# EAGLE design SUPEROLED8 (EAGLE 6.5.0)
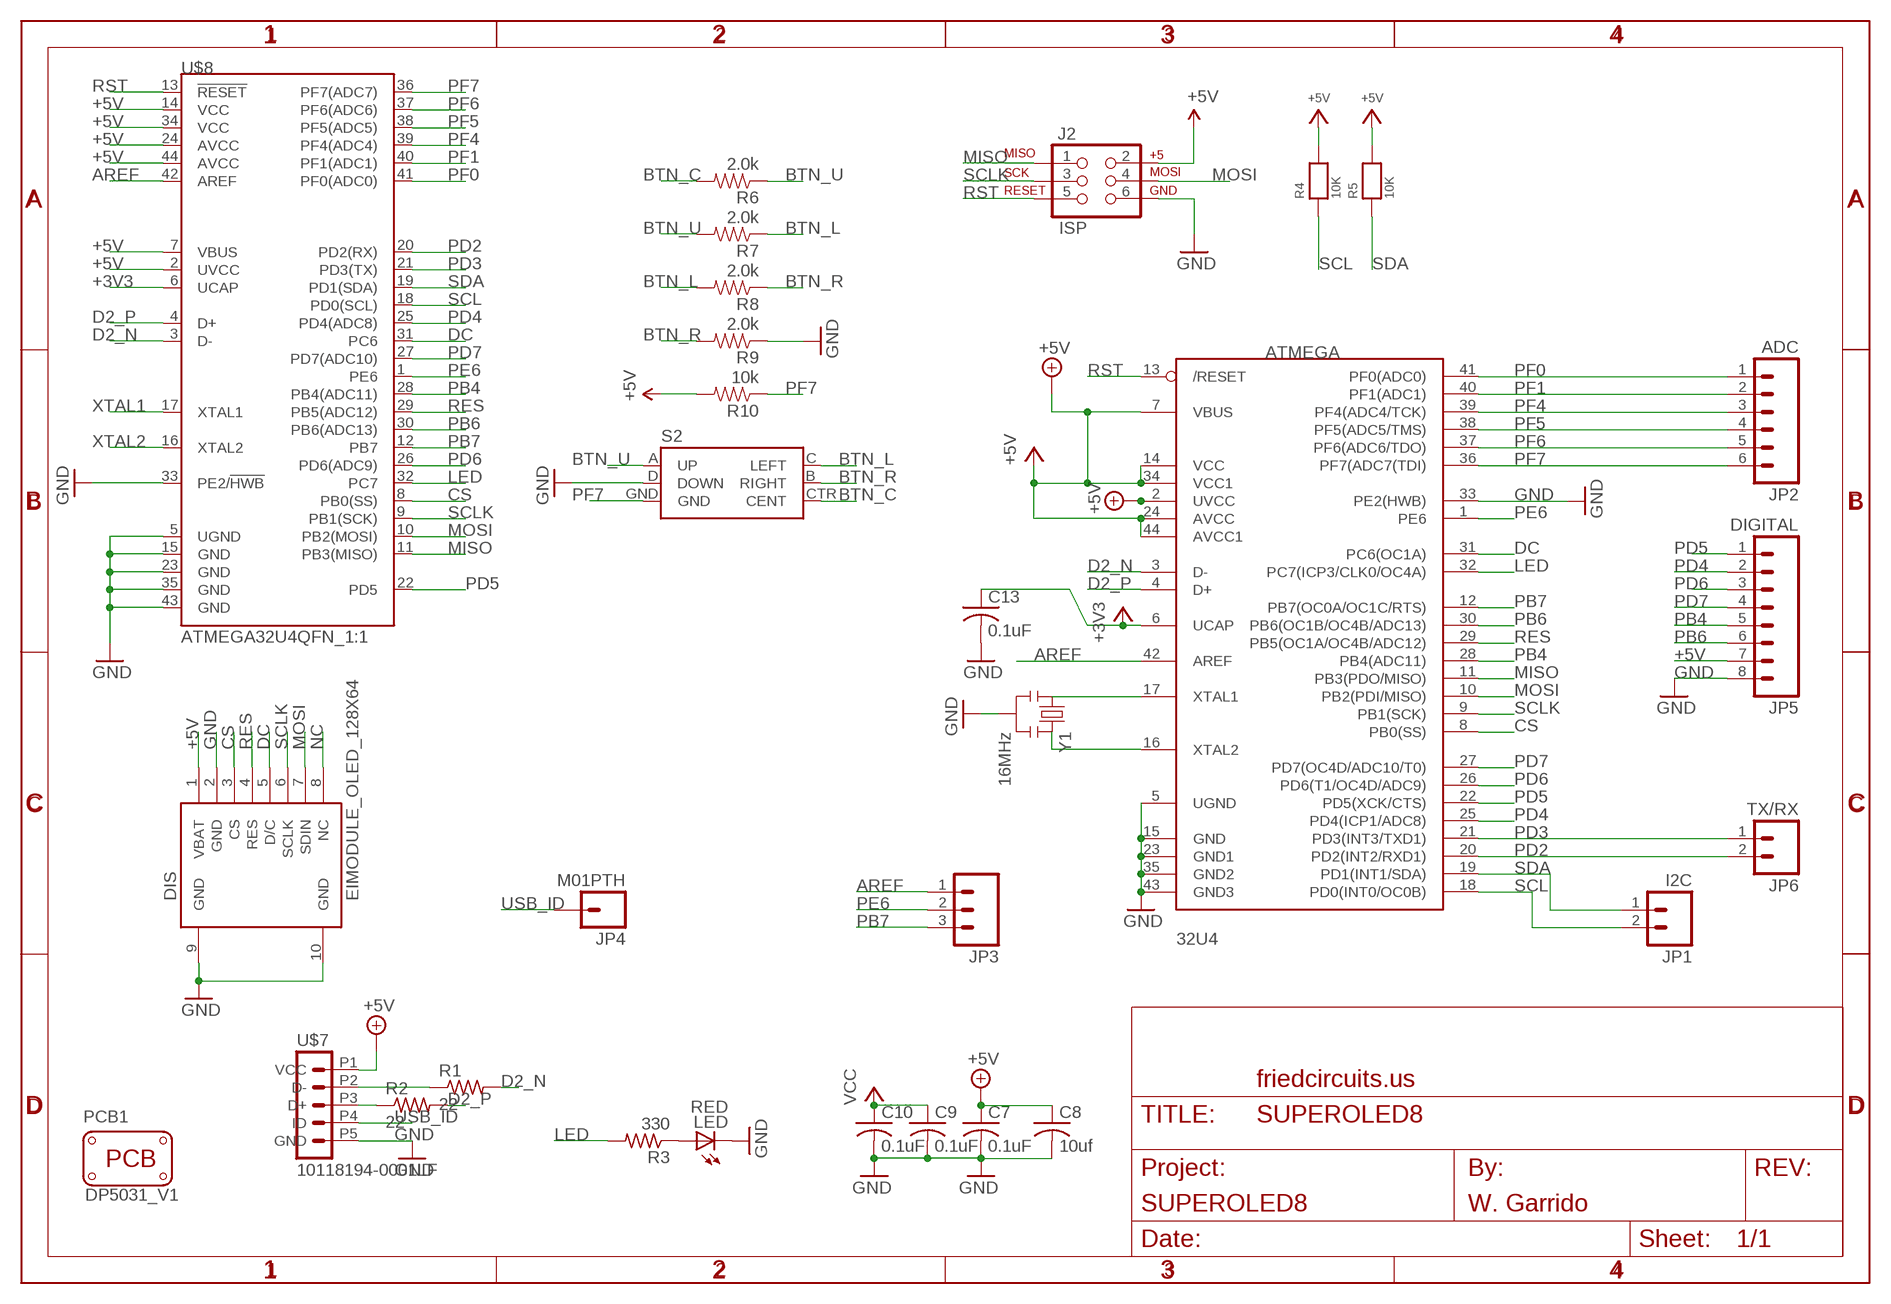
[diagram p0: schematic, sheet 1]

## Parts
32U4  ATMEGA  ATMEGA32U4-AU  [TQFP44]
C7  0.1uF  C-USC0805K  [C0805K]
C8  10uf  C-USC0805K  [C0805K]
C9  0.1uF  C-USC0805K  [C0805K]
C10  0.1uF  C-USC0805K  [C0805K]
C13  0.1uF  C-USC0805K  [C0805K]
DIS  EIMODULE_OLED_128X64  [EIMODULE_OLED_128X64]
J2  ISP  AVR_SPI_PRG_62X3_LOCK  [2X3_LOCK]
JP1  I2C  M02LOCK  [1X02_LOCK]
JP2  ADC  M06LOCK  [1X06_LOCK]
JP3  M03LOCK  [1X03_LOCK]
JP4  M01PTH  [1X01]
JP5  DIGITAL  M08LOCK  [1X08_LOCK]
JP6  TX/RX  M02LOCK  [1X02_LOCK]
LED  RED  LEDCHIPLED_0805  [CHIPLED_0805]
PCB1  PCB_DP_RECTANGLE-31X50  [DP5031_V1]
R1  22  R-US_R0805  [R0805]
R2  22  R-US_R0805  [R0805]
R3  330  R-US_R0805  [R0805]
R4  10K  RESISTOR0805  [0805]
R5  10K  RESISTOR0805  [0805]
R6  2.0k  2.0KOHM1/10W5%(0603)  [0603-RES]
R7  2.0k  2.0KOHM1/10W5%(0603)  [0603-RES]
R8  2.0k  2.0KOHM1/10W5%(0603)  [0603-RES]
R9  2.0k  2.0KOHM1/10W5%(0603)  [0603-RES]
R10  10k  2.0KOHM1/10W5%(0603)  [0603-RES]
S2  JOYSTICK_MINI  [JOYSTICK_MINI]
U$1  FRAME_DINA4_L  [FC_CREDIT]
U$7  10118194-0001LF  [10118194-0001LF]
U$8  ATMEGA32U4QFN_1:1  [QFN-44-NOPAD_1:1]
Y1  16MHz  RESONATOR16MHZ  [RESONATOR-SMD]

## Nets
+3V3 [+3V3]: 32U4.6(UCAP) C13.1 U$8.6(UCAP)
+5V [+5V]: 32U4.2(UVCC) 32U4.7(VBUS) 32U4.14(VCC) 32U4.24(AVCC) 32U4.34(VCC1) 32U4.44(AVCC1) C7.1 C8.1 C9.1 C10.1 DIS.1(VBAT) J2.2 JP5.7 R4.2 R5.2 R10.2 U$7.P1(VCC) U$8.2(UVCC) U$8.7(VBUS) U$8.14(VCC) U$8.24(AVCC) U$8.34(VCC) U$8.44(AVCC) ; supply symbol labelled VCC
AREF: 32U4.42(AREF) JP3.1 U$8.42(AREF)
BTN_C: R6.2 S2.CTR(CENT)
BTN_L: R7.1 R8.2 S2.C(LEFT)
BTN_R: R8.1 R9.2 S2.B(RIGHT)
BTN_U: R6.1 R7.2 S2.A(UP)
CS: 32U4.8(PB0(SS)) DIS.3(CS) U$8.8(PB0(SS))
D2_N [USB]: 32U4.3(D-) R1.2 U$8.3(D-)
D2_P [USB]: 32U4.4(D+) R2.2 U$8.4(D+)
DC: 32U4.31(PC6(OC1A)) DIS.5(D/C) U$8.31(PC6)
GND: 32U4.5(UGND) 32U4.15(GND) 32U4.23(GND1) 32U4.33(PE2(HWB)) 32U4.35(GND2) 32U4.43(GND3) C7.2 C8.2 C9.2 C10.2 C13.2 DIS.2(GND) DIS.9(GND) DIS.10(GND) J2.6 JP5.8 LED.C R9.1 S2.D(DOWN) U$7.P5(GND) U$8.5(UGND) U$8.15(GND) U$8.23(GND) U$8.35(GND) U$8.43(GND) Y1.2
LED: 32U4.32(PC7(ICP3/CLK0/OC4A)) R3.2 U$8.32(PC7)
MISO: 32U4.11(PB3(PDO/MISO)) J2.1 U$8.11(PB3(MISO))
MOSI: 32U4.10(PB2(PDI/MISO)) DIS.7(SDIN) J2.4 U$8.10(PB2(MOSI))
N$1: LED.A R3.1
N$25: U$8.33(PE2/!HWB)
NC: DIS.8(NC)
PB4: 32U4.28(PB4(ADC11)) JP5.5 U$8.28(PB4(ADC11))
PB6: 32U4.30(PB6(OC1B/OC4B/ADC13)) JP5.6 U$8.30(PB6(ADC13))
PB7: 32U4.12(PB7(OC0A/OC1C/RTS)) JP3.3 U$8.12(PB7)
PD2: 32U4.20(PD2(INT2/RXD1)) JP6.2 U$8.20(PD2(RX))
PD3: 32U4.21(PD3(INT3/TXD1)) JP6.1 U$8.21(PD3(TX))
PD4: 32U4.25(PD4(ICP1/ADC8)) JP5.2 U$8.25(PD4(ADC8))
PD5: 32U4.22(PD5(XCK/CTS)) JP5.1 U$8.22(PD5)
PD6: 32U4.26(PD6(T1/OC4D/ADC9)) JP5.3 U$8.26(PD6(ADC9))
PD7: 32U4.27(PD7(OC4D/ADC10/T0)) JP5.4 U$8.27(PD7(ADC10))
PE6: 32U4.1(PE6) JP3.2 U$8.1(PE6)
PF0: 32U4.41(PF0(ADC0)) JP2.1 U$8.41(PF0(ADC0))
PF1: 32U4.40(PF1(ADC1)) JP2.2 U$8.40(PF1(ADC1))
PF4: 32U4.39(PF4(ADC4/TCK)) JP2.3 U$8.39(PF4(ADC4))
PF5: 32U4.38(PF5(ADC5/TMS)) JP2.4 U$8.38(PF5(ADC5))
PF6: 32U4.37(PF6(ADC6/TDO)) JP2.5 U$8.37(PF6(ADC6))
PF7: 32U4.36(PF7(ADC7(TDI)) JP2.6 R10.1 S2.GND U$8.36(PF7(ADC7))
RES: 32U4.29(PB5(OC1A/OC4B/ADC12)) DIS.4(RES) U$8.29(PB5(ADC12))
RST: 32U4.13(/RESET) J2.5 U$8.13(!RESET)
SCL: 32U4.18(PD0(INT0/OC0B)) JP1.2 R4.1 U$8.18(PD0(SCL))
SCLK: 32U4.9(PB1(SCK)) DIS.6(SCLK) J2.3 U$8.9(PB1(SCK))
SDA: 32U4.19(PD1(INT1/SDA)) JP1.1 R5.1 U$8.19(PD1(SDA))
USB_C_N [USB]: R1.1 U$7.P2(D-)
USB_C_P [USB]: R2.1 U$7.P3(D+)
USB_ID: JP4.1 U$7.P4(ID)
XTAL1: 32U4.17(XTAL1) U$8.17(XTAL1) Y1.1
XTAL2: 32U4.16(XTAL2) U$8.16(XTAL2) Y1.3

## Library data of the parts
32U4 = adafruit:ATMEGA32U4: http://www.ladyada.net/library/eagle
C7-C10 C13 = adafruit:C-US: CAPACITOR, American symbol
DIS = FriedCircuits:EIMODULE_OLED_128X64
J2 = SparkFun-Connectors:AVR_SPI_PRG_6: AVR ISP 6 Pin This is the reduced ISP connector for AVR programming. Common on Arduino. This footprint will take up less PCB space and can be used with a 10-pin to 6-pin adapter such as SKU: BOB-08508
JP1 JP6 = SparkFun-Connectors:M02: Standard 2-pin 0.1" header. Use with - straight break away headers ( PRT-00116) - right angle break away headers (PRT-00553) - swiss pins (PRT-00743) - machine pins (PRT-00117) - female headers (PRT-00115) Molex polarized connector foot print use with: PRT-08233 with associated crimp pins and housings. 2.54_SCREWTERM for use with PRT-10571. 3.5mm Screw Terminal footprints for PRT-08084 5mm Screw Terminal footprints for use with PRT-08433
JP2 = SparkFun-Connectors:M06: Header 6 Standard 6-pin 0.1" header. Use with straight break away headers (SKU : PRT-00116), right angle break away headers (PRT-00553), swiss pins (PRT-00743), machine pins (PRT-00117), and female headers (PRT-00115). Molex polarized connector foot print use with SKU : PRT-08094 with associated crimp pins and housings. NOTES ON THE VARIANTS LOCK and LOCK_LONGPADS... This footprint was designed to help hold the alignment of a through-hole component (i.e. 6-pin header) while soldering it into place. You may notice that each hole has been shifted either up or down by 0.005 of an inch from it's more standard position (which is a perfectly straight line). This slight alteration caused the pins (the squares in the middle) to touch the edges of the holes. Because they are alternating, it causes a "brace" to hold the component in place. 0.005 has proven to be the perfect amount of "off-center" position when using our standard breakaway headers. Although looks a little odd when you look at the bare footprint, once you have a header in there, the alteration is very hard to notice. Also,if you push a header all the way into place, it is covered up entirely on the bottom side. This idea of altering the position of holes to aid alignment will be further integrated into the Sparkfun Library for other footprints. It can help hold any component with 3 or more connection pins.
JP3 = SparkFun-Connectors:M03: Header 3 Standard 3-pin 0.1" header. Use with straight break away headers (SKU : PRT-00116), right angle break away headers (PRT-00553), swiss pins (PRT-00743), machine pins (PRT-00117), and female headers (PRT-00115). Molex polarized connector foot print use with SKU : PRT-08232 with associated crimp pins and housings.
JP4 = SparkFun-Connectors:M01: Header 1 Standard 1-pin 0.1" header. Use with straight break away headers (SKU : PRT-00116), right angle break away headers (PRT-00553), swiss pins (PRT-00743), machine pins (PRT-00117), and female headers (PRT-00115).
JP5 = SparkFun-Connectors:M08: Header 8 Standard 8-pin 0.1" header. Use with straight break away headers (SKU : PRT-00116), right angle break away headers (PRT-00553), swiss pins (PRT-00743), machine pins (PRT-00117), and female headers (PRT-00115).
LED = adafruit:LED: LED OSRAM: - CHIPLED LG R971, LG N971, LY N971, LG Q971, LY Q971, LO R971, LY R971 LH N974, LH R974 LS Q976, LO Q976, LY Q976 LO Q996 - Hyper CHIPLED LW Q18S LB Q993, LB Q99A, LB R99A - SideLED LS A670, LO A670, LY A670, LG A670, LP A670 LB A673, LV A673, LT A673, LW A673 LH A674 LY A675 LS A676, LA A676, LO A676, LY A676, LW A676 LS A679, LY A679, LG A679 - Hyper Micro SIDELED® LS Y876, LA Y876, LO Y876, LY Y876 LT Y87S - SmartLED LW L88C, LW L88S LB L89C, LB L89S, LG L890 LS L89K, LO L89K, LY L89K LS L896, LA L896, LO L896, LY L896 - TOPLED LS T670, LO T670, LY T670, LG T670, LP T670 LSG T670, LSP T670, LSY T670, LOP T670, LYG T670 LG T671, LOG T671, LSG T671 LB T673, LV T673, LT T673, LW T673 LH T674 LS T676, LA T676, LO T676, LY T676, LB T676, LH T676, LSB T676, LW T676 LB T67C, LV T67C, LT T67C, LS T67K, LO T67K, LY T67K, LW E67C LS E67B, LA E67B, LO E67B, LY E67B, LB E67C, LV E67C, LT E67C LW T67C LS T679, LY T679, LG T679 LS T770, LO T770, LY T770, LG T770, LP T770 LB T773, LV T773, LT T773, LW T773 LH T774 LS E675, LA E675, LY E675, LS T675 LS T776, LA T776, LO T776, LY T776, LB T776 LHGB T686 LT T68C, LB T68C - Hyper Mini TOPLED® LB M676 - Mini TOPLED Santana® LG M470 LS M47K, LO M47K, LY M47K Source: http://www.osram.convergy.de/
PCB1 = dp_devices:PCB_DP_RECTANGLE: Dangerous Prototypes Standard Rectangular PCB sizes; PCB_SIZE: DP5031_V1
R1-R3 = adafruit:R-US_: RESISTOR, American symbol
R4 R5 = microbuilder:RESISTOR: Resistors 0402 - 0402 Surface Mount Package 22 Ohm 1% 1/16W [Digikey: 311-22.0LRTR-ND] 33 Ohm 5% 1/16W 1.0K 5% 1/16W 1.5K 5% 1/16W 2.0K 1% 1/16W 10.0K 1% 1/16W [Digikey: 311-10.0KLRTR-ND] 10.0K 5% 1/16W [Digikey: RMCF0402JT10K0TR-ND] 12.1K 1% 1/16W [Digikey: 311-22.0LRTR-ND] 100.0K 5% 1/16W 0603 - 0603 Surface Mount Package 0 Ohm 1/10 Watt 1% Resistor 15 Ohm 1/10 Watt 1% Resistor 33 Ohm 1/10 Watt 1% Resistor 49.9 Ohm 1/10 Watt 1% Resistor 100 Ohm 1/10 Watt 1% Resistor 150 Ohm 1/10 Watt 1% Resistor 240 Ohm 1/10 Watt 1% Resistor 390 Ohm 1/10 Watt 1% Resistor 560 Ohm 1/10 Watt 1% Resistor 680 Ohm 1/10 Watt 1% Resistor 750 Ohm 1/10 Watt 1% Resistor 1.0K Ohm 1/10 Watt 1% Resistor 1.5K Ohm 1/10 Watt 1% Resistor 2.0K Ohm 1/10 Watt 1% Resistor 2.2K Ohm 1/10 Watt 1% Resistor 3.3K Ohm 1/10 Watt 1% Resistor 4.7K Ohm 1/10 Watt 1% Resistor 10.0K Ohm 1/10 Watt 1% Resistor 12.0K Ohm 1/10 Watt 1% Resistor 12.1K Ohm 1/10 Watt 1% Resistor 20.0K Ohm 1/10 Watt 1% Resistor 33.0K Ohm 1/10 Watt 1% Resistor 100.0K Ohm 1/10 Watt 1% Resistor 0805 - 0805 Surface Mount Package 0 Ohm 1/8 Watt 1% Resistor 33 Ohm 1/8 Watt 1% Resistor 100 Ohm 1/8 Watt 1% Resistor 150 Ohm 1/8 Watt 1% Resistor 200 Ohm 1/8 Watt 1% Resistor 240 Ohm 1/8 Watt 1% Resistor 330 Ohm 1/8 Watt 1% Resistor 390 Ohm 1/8 Watt 1% Resistor 470 Ohm 1/8 Watt 1% Resistor 1.0K Ohm 1/8 Watt 1% Resistor 1.5K Ohm 1/8 Watt 1% Resistor 2.0K Ohm 1/8 Watt 1% Resistor 4.7K Ohm 1/8 Watt 1% Resistor 5.1K Ohm 1/8 Watt 1% Resistor 5.6K Ohm 1/8 Watt 1% Resistor 10.0K Ohm 1/8 Watt 1% Resistor 22.0K Ohm 1/8 Watt 1% Resistor 33.0K Ohm 1/8 Watt 1% Resistor 100K Ohm 1/8 Watt 1% Resistor 1206 - 1206 Surface Mount Package 2012 - 2010 Surface Mount Package 0.11 Ohm 1/2 Watt 1% Resistor - Digikey: RHM.11UCT-ND
R6-R9 = SparkFun-Resistors:2.0KOHM1/10W5%(0603): RES-08296; PROD_ID: RES-08296
R10 = SparkFun-Resistors:2.0KOHM1/10W5%(0603): RES-08296; PROD_ID: RES-08296; VALUE: 2.0k
S2 = SparkFun-Electromechanical:JOYSTICK_MINI: Small 5-way tactile joystick, COM-10063 4UCON SF303GJ26; PROD_ID: SWCH-09905
U$1 = FriedCircuits:FRAME_DINA4_L: A4 FC frame Standard FriedCircuits schematic frame. Automagically adds the standard texts to the PCB Use the atrribute in the schematic editor to change the fields.; AUTHOR: W. Garrido; FF3: friedcircuits.us; PROJECT: SUPEROLED8; URL2: friedcircuits.us
U$7 = FriedCircuits:10118194-0001LF: Thanks to Leon Marure for this footprint https://mywebspace.wisc.edu/lnmaurer/web/FloatingAway/FloatingAway.html leon.maurer@gmail.com https://mywebspace.wisc.edu/lnmaurer/web/ Friedcircuits - Added ID pin to schamtic.
U$8 = SparkFun-DigitalIC:ATMEGA32U4: Atmel 44-pin 8-bit Microcontroller with 32KBytes of ISP Flash and USB Controller ----- Please use the QFN-44-NOPAD_1:1 package for the footprint of all boards using a 32U4. Route traces directly away from the pads as much as possible.
Y1 = SparkFun-FreqCtrl:RESONATOR: Resonator Small SMD resonator. Used, eg, on the Arduino Pro/ Pro Mini boards. 8MHz- XTAL-08895 16MHz- XTAL-08900; PROD_ID: XTAL-08900

## Net classes
0 default: width 0.203 mm, drill 0.254 mm, clearance 0.152 mm
1 VCC: width 0.254 mm, drill 0.254 mm, clearance 0.152 mm
2 VBUS: width 0.406 mm, drill 0.254 mm, clearance 0.152 mm
3 +5V: width 0.254 mm, drill 0.254 mm, clearance 0.152 mm
4 +3V3: width 0.254 mm, drill 0.254 mm, clearance 0.152 mm
5 USB: width 0.203 mm, drill 0.254 mm, clearance 0.2 mm

## Board
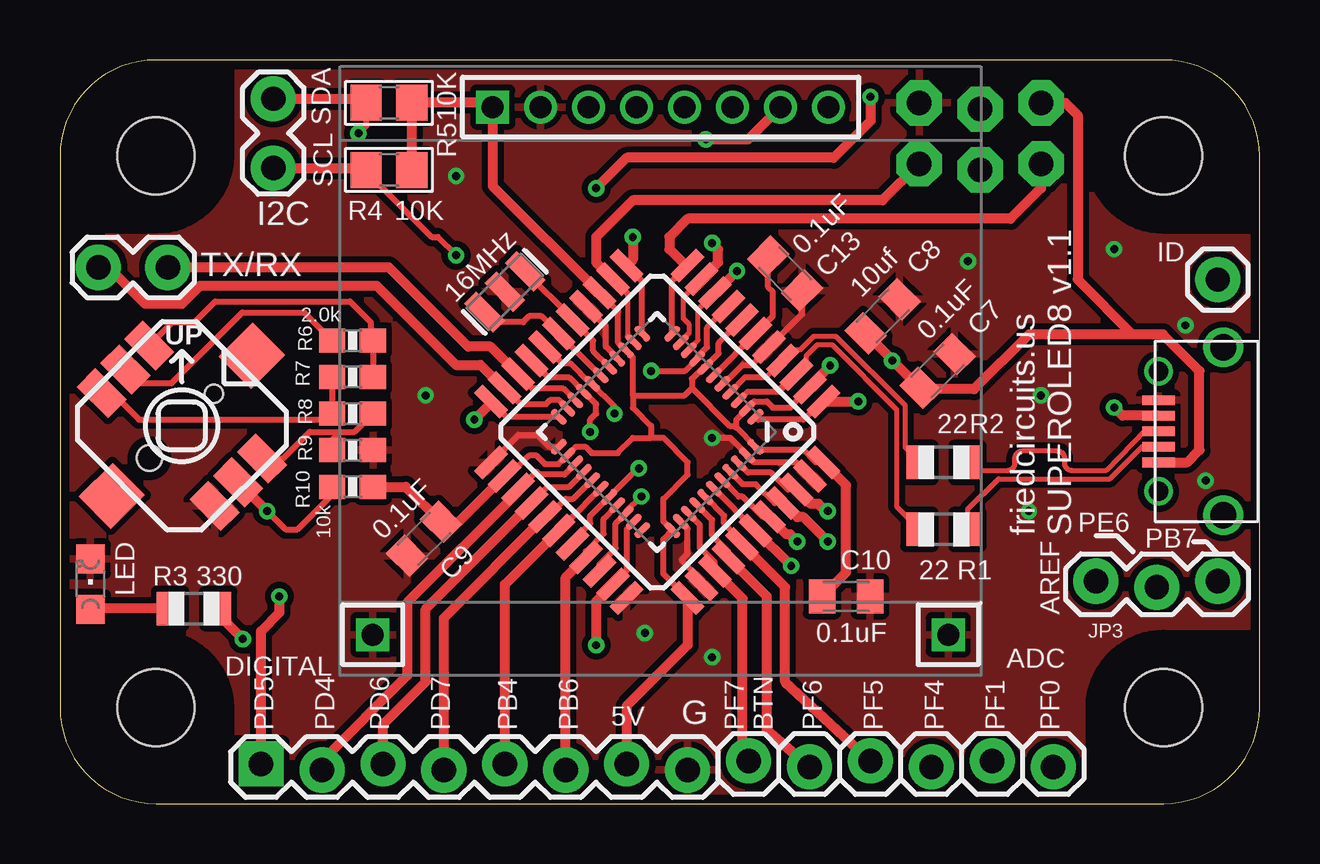
[diagram p1: board, top side]
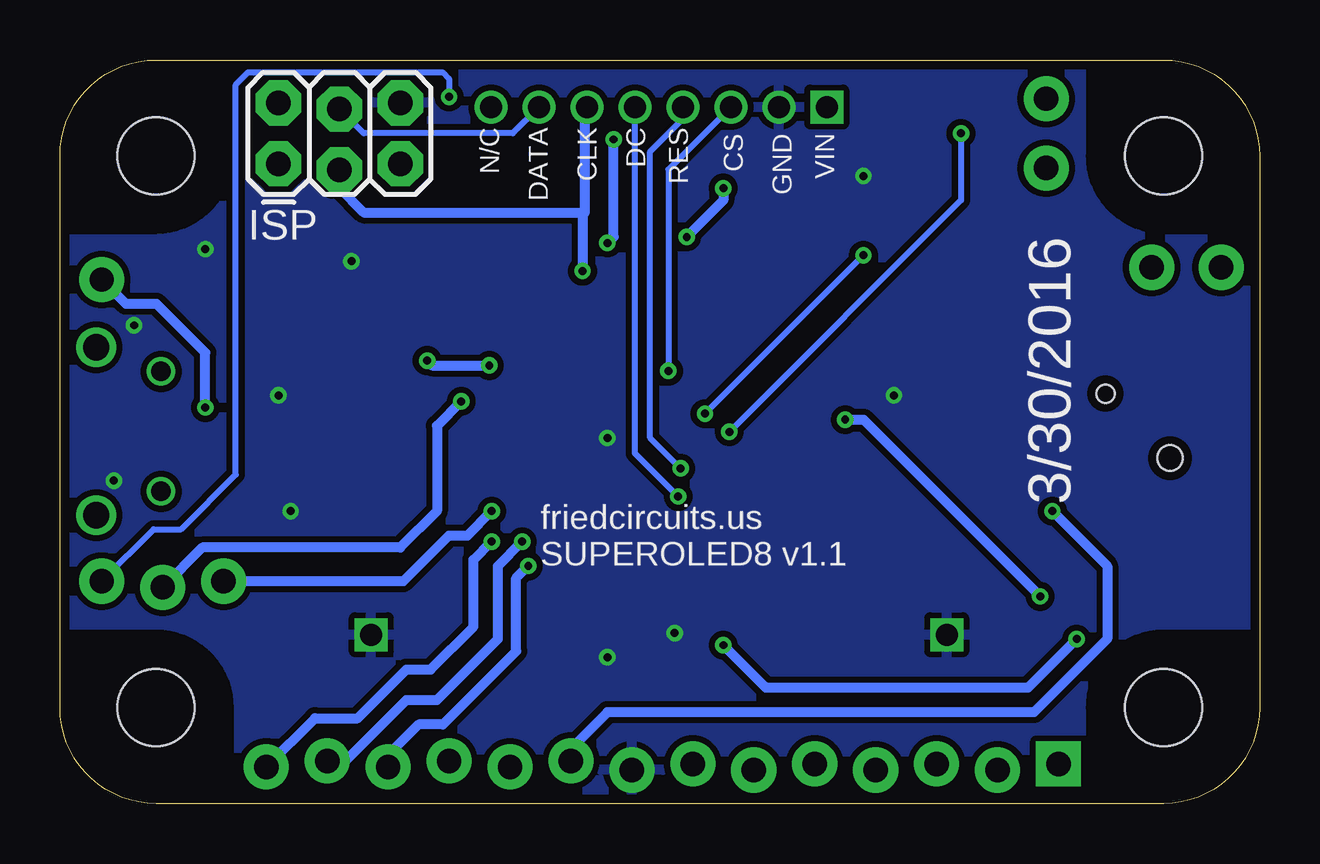
[diagram p2: board, bottom side, seen from below]

Size 50 x 31 mm. Coordinates in mm from the lower left corner, seen from the top.
Copper layers (1*16): Top 0.0356mm / dielectric 1.5011mm / Bottom 0.0356mm
Design rules "LaenPCBOrder *": minimum track width 6mil, minimum drill 13mil, track to track 6mil, track to pad 6mil, pad to pad 6mil, via to via 6mil, smd to smd 6mil, copper to edge 15mil, drill to drill 6mil, minimum pad ring 7mil, minimum via ring 7mil, stop-mask expansion 3mil, vias tented up to drill 13mil, thermal gap 10mil

### Footprints (pad centres in the part's own frame; a part is rotated, then mirrored left to right if it is on the bottom)
TQFP44 = smd 1.5 x 0.5: 1 -5.8,4; 2 -5.8,3.2; 3 -5.8,2.4; 4 -5.8,1.6; 5 -5.8,0.8; 6 -5.8,0; 7 -5.8,-0.8; 8 -5.8,-1.6; 9 -5.8,-2.4; 10 -5.8,-3.2; 11 -5.8,-4; 23 5.8,-4; 24 5.8,-3.2; 25 5.8,-2.4; 26 5.8,-1.6; 27 5.8,-0.8; 28 5.8,0; 29 5.8,0.8; 30 5.8,1.6; 31 5.8,2.4; 32 5.8,3.2; 33 5.8,4 | smd 0.5 x 1.5: 12 -4,-5.8; 13 -3.2,-5.8; 14 -2.4,-5.8; 15 -1.6,-5.8; 16 -0.8,-5.8; 17 0,-5.8; 18 0.8,-5.8; 19 1.6,-5.8; 20 2.4,-5.8; 21 3.2,-5.8; 22 4,-5.8; 34 4,5.8; 35 3.2,5.8; 36 2.4,5.8; 37 1.6,5.8; 38 0.8,5.8; 39 0,5.8; 40 -0.8,5.8; 41 -1.6,5.8; 42 -2.4,5.8; 43 -3.2,5.8; 44 -4,5.8
C0805K = smd 1.1 x 1.4: 1 -1,0; 2 1,0
EIMODULE_OLED_128X64 = drill 0.914 square: 1 6.35,23.7; 9 1.35,1.7; 10 25.34,1.7 | drill 0.914: 2 8.35,23.7; 3 10.35,23.7; 4 12.35,23.7; 5 14.35,23.7; 6 16.35,23.7; 7 18.35,23.7; 8 20.35,23.7
2X3_LOCK = drill 1.016 pad 1.88 octagon: 1 0,0; 2 0,2.54; 3 2.54,-0.254; 4 2.54,2.286; 5 5.08,0; 6 5.08,2.54
1X02_LOCK = drill 1.016 pad 1.88: 1 -0.178,0; 2 2.718,0
1X06_LOCK = drill 1.016 pad 1.88: 1 0,0; 2 2.54,-0.254; 3 5.08,0; 4 7.62,-0.254; 5 10.16,0; 6 12.7,-0.254
1X03_LOCK = drill 1.016 pad 1.88: 1 0,0.127; 2 2.54,-0.127; 3 5.08,0.127
1X01 = drill 1.016 pad 1.88: 1 0,0
1X08_LOCK = drill 1.016 pad 1.88 square: 1 0,0.127 | drill 1.016 pad 1.88: 2 2.54,-0.127; 3 5.08,0.127; 4 7.62,-0.127; 5 10.16,0.127; 6 12.7,-0.127; 7 15.24,0.127; 8 17.78,-0.127
CHIPLED_0805 = smd 1.2 x 1.2: A 0,-1.05; C 0,1.05
DP5031_V1 = hole 3.2: 4,4; 46,4; 46,27; 4,27
R0805 = smd 1.1 x 1.4: 1 -1,0; 2 1,0
0805 = smd 1.3 x 1.5: 1 -0.95,0; 2 0.95,0
0603-RES = smd 1.1 x 1: 1 -0.85,0; 2 0.85,0
JOYSTICK_MINI = smd 1.85 x 1.1: A -3.325,1.4; B 3.325,1.4; C -3.325,-1.4; CTR -3.325,0; D 3.325,-1.4; GND 3.325,0 | smd 1.9 x 2: NC 0,4.13; NC@0 0,-4.13 | hole 0.75: 0,1.9 | hole 1.05: 0,-1.9
10118194-0001LF = smd 0.4 x 1.35: P1 -1.3,2.7; P2 -0.65,2.7; P3 0,2.7; P4 0.65,2.7; P5 1.3,2.7 | drill 1.1: P$1 -3.5,0; P$2 3.5,0 | drill 0.8: P$3 -2.5,2.7; P$4 2.5,2.7
QFN-44-NOPAD_1:1 = smd 0.8 x 0.3: 1 -3.337,2.458; 2 -3.337,1.958; 3 -3.337,1.479; 4 -3.337,0.979; 5 -3.337,0.5; 6 -3.337,0; 7 -3.337,-0.5; 8 -3.337,-0.979; 9 -3.337,-1.479; 10 -3.337,-1.958; 11 -3.337,-2.458; 23 3.337,-2.458; 24 3.337,-1.958; 25 3.337,-1.479; 26 3.337,-0.979; 27 3.337,-0.5; 28 3.337,0; 29 3.337,0.5; 30 3.337,0.979; 31 3.337,1.479; 32 3.337,1.958; 33 3.337,2.458 | smd 0.3 x 0.8: 12 -2.458,-3.337; 13 -1.958,-3.337; 14 -1.479,-3.337; 15 -0.979,-3.337; 16 -0.5,-3.337; 17 0,-3.337; 18 0.5,-3.337; 19 0.979,-3.337; 20 1.479,-3.337; 21 1.958,-3.337; 22 2.458,-3.337; 34 2.458,3.337; 35 1.958,3.337; 36 1.479,3.337; 37 0.979,3.337; 38 0.5,3.337; 39 0,3.337; 40 -0.5,3.337; 41 -0.979,3.337; 42 -1.479,3.337; 43 -1.958,3.337; 44 -2.458,3.337
RESONATOR-SMD = smd 0.7 x 1.7: 1 -1.2,0; 2 0,0; 3 1.2,0

### Placement (x,y rotation side)
32U4  24.89,15.49 225 top
C7  36.58,18.03 45 top
C8  34.29,20.32 45 top
C9  15.17,11.04 225 top
C10  32.77,8.64 0 top
C13  30.23,22.1 315 top
DIS  11.68,5.33 0 top
J2  40.89,26.67 0 bottom
JP1  8.89,29.21 270 top
JP2  41.4,1.52 180 top
JP3  43.18,9.14 0 top
JP4  48.26,21.84 0 top
JP5  8.38,1.52 0 top
JP6  1.78,22.35 0 top
LED  1.27,9.14 0 top
PCB1  0,0 0 top
R1  36.83,11.43 180 top
R2  36.83,14.22 180 top
R3  5.59,8.13 0 top
R4  13.72,26.42 0 top
R5  13.72,29.21 0 top
R6  12.19,19.3 180 top
R7  12.19,17.78 0 top
R8  12.19,16.26 180 top
R9  12.19,14.73 180 top
R10  12.19,13.21 0 top
S2  5.08,15.75 315 top
U$1  0,0 0 top
U$7  48.49,15.52 90 top
U$8  24.89,15.49 225 top
Y1  18.54,21.34 45 top

### Tracks (layer width: path | path; a pad name or v marks a point on that pad's centre or on a via)
+3V3
  Top 0.254: U$8.6 32U4.6 29.72,20.32 29.72,21.34 29.52,21.54 C13.1
+5V  (via drill 0.33)
  Top 0.254: 32U4.24 18.71,13.66 19.56,14.5 19.86,14.5 20.22,14.15 20.78,14.15 U$8.24 | 32U4.34 25.15,9.58 25.15,11.03 U$8.34 25.15,11.76 25.15,12.7 26.16,13.72 26.16,14.22 25.15,15.24 24.64,15.24 | 32U4.44 31.5,14.22 30.99,14.73 29.13,14.73 U$8.44 28.19,15.67 28.19,15.75 | 32U4.2 30.43,16.51 29.72,16.51 29.46,16.76 28.93,16.76 U$8.2 28.64,16.44 28.19,16 28.19,15.75 | 32U4.7 27.46,19.19 27.46,18.77 U$8.7 26.84,18.21 26.34,17.7 26.34,17.32 | 26.34,17.32 27.91,15.75 28.19,15.75 | 23.88,17.02 26.04,17.02 26.34,17.32 | 23.88,17.02 23.88,18.6 U$8.14 23.27,19.21 23.27,20.51 32U4.14 | 23.88,17.02 23.88,16.51 24.64,15.75 24.64,15.24 | 24.64,15.24 23.88,15.24 23.24,14.61 22.17,14.61 21.92,14.86 21.49,14.86 U$8.24 | 20.9,14.27 U$8.24
  Top 0.406: 32U4.24 16.62,11.74 C9.1 14.42,13.21 R10.2 | 32U4.34 26.16,6.61 23.62,4.06 JP5.7 | 32U4.14 18.03,25.75 DIS.1 17.86,29.21 R5.2 R4.2 | C10.1 32.77,9.64 32.77,13.28 32U4.44 | 32U4.2 31.26,17.41 v32.11,18.26 | C8.1 34.7,18.5 v34.7,18.47 35.84,17.33 C7.1 35.92,17.27 38.1,17.27 40.39,19.56 44.7,19.56 | U$7.P1 46.98,14.22 47.5,14.73 47.5,18.03 45.97,19.56 44.7,19.56 | J2.2 41.91,29.21 42.42,28.7 42.42,21.84 44.7,19.56
  Bottom 0.406: v34.7,18.47 34.49,18.26 v32.11,18.26
AREF  (via drill 0.33)
  Top 0.254: 32U4.42 30.34,13.09 29.64,13.79 28.69,13.79 U$8.42
  Top 0.406: v32,12.19 31.93,12.19 31.62,12.5 31.28,12.5 32U4.42
  Bottom 0.406: JP3.1 35.69,9.27 33.78,11.18 33.02,11.18 v32,12.19
BTN_C
  Top 0.254: S2.CTR 3.3,17.53 4.65,17.53 7.6,20.47 10.17,20.47 R6.2
BTN_L
  Top 0.254: R7.1 R8.2 11.09,16 3.3,16 2.2,17.11 S2.C
BTN_R
  Top 0.254: S2.B 9.31,14.39 10.41,15.49 11.68,15.49 | R9.2 11.34,15.15 11.68,15.49 | 11.68,15.49 12.28,15.49 R8.1
BTN_U
  Top 0.254: S2.A 4.7,20.07 5.61,20.07 6.48,20.93 12.09,20.93 12.95,20.07 12.95,19.39 R6.1 | 13.04,19.72 R6.1 | R6.1 R7.2
CS  (via drill 0.33)
  Top 0.254: 32U4.8 26.98,19.84 26.98,19.02 26.56,18.61 U$8.8 26.05,18.03 v24.64,18.03
  Bottom 0.254: DIS.3 24.64,26.43 v24.64,18.03
D2_N
  Top 0.203: 29.96,17.17 29.96,17.26 31.11,18.41 31.11,18.67 31.57,19.13 32.18,19.13 34.87,16.44 34.87,12.39 R1.2
  Top 0.254: U$8.3 28.66,17.17 29.96,17.17 32U4.3
D2_P
  Top 0.203: 29.44,17.78 32U4.4 30.58,18.92 30.86,18.92 31.42,19.48 32.33,19.48 35.23,16.58 35.23,14.82 R2.2
  Top 0.254: U$8.4 28.56,17.78 29.44,17.78
DC  (via drill 0.33)
  Top 0.254: 32U4.31 22.49,9.97 23.16,10.64 23.16,11.68 U$8.31 23.58,12.15 v24.23,12.8
  Bottom 0.254: v24.23,12.8 26.03,14.6 DIS.5
GND  (via drill 0.33)
  Top 0.254: 32U4.23 19.11,15.37 19.91,15.37 20.41,14.87 U$8.23 | 32U4.35 26.73,9.34 25.91,10.16 26.16,10.41 26.16,11.45 U$8.35 | 32U4.43 30.69,14.22 28.93,14.22 U$8.43 28.64,14.54 27.94,15.24 v27.18,15.24 | U$8.5 27.66,17.5 28.45,18.29 28.82,18.29 32U4.5 30.93,20.4 C13.2 | U$8.15 23.23,18.58 22.76,19.05 22.76,19.89 32U4.15
  other vias: 16.51,26.16 37.85,22.61 27.18,6.1 24.38,7.11 40.39,12.19 43.94,23.11 40.89,17.02 47.75,13.46 46.91,19.94 15.24,17.02
  pour Top (isolate 0.254): 0,31.24 0,0 50.55,0.25 50.55,31.5
  pour Bottom (isolate 0.254): 0,0 50.8,0 50.8,31.75 0,31.75
LED  (via drill 0.33)
  Top 0.254: U$8.32 23.92,11.73 23.62,11.43 23.62,9.7 32U4.32
  Top 0.406: 32U4.32 22.35,8.43 v22.35,6.6 | v7.62,6.86 6.59,7.89 R3.2
  Bottom 0.406: v22.35,6.6 20.57,4.83 9.65,4.83 v7.62,6.86
MISO
  Top 0.254: U$8.11 25.51,21.77 32U4.11
  Top 0.406: J2.1 40.89,25.65 39.62,24.38 26.16,24.38 25.4,23.62 25.4,23.11 26.09,22.42 32U4.11
MOSI  (via drill 0.33)
  Top 0.203: U$8.10 25.87,19.26 26.24,19.63 26.24,19.96 25.98,20.22 25.98,21.11 32U4.10
  Top 0.406: 32U4.10 27.43,22.56 27.43,23.11 v27.18,23.37 | DIS.7 28.69,27.69 v26.92,27.69
  Bottom 0.254: DIS.7 31.13,27.94 37.34,27.94 J2.4
  Bottom 0.406: v27.18,23.37 26.92,23.62 v26.92,27.69
N$1
  Top 0.406: R3.1 1.3,8.13 LED.A
PB4
  Top 0.254: 32U4.28 21.21,11.81 U$8.28
  Top 0.406: JP5.5 18.54,9.14 21.21,11.81
PB6
  Top 0.254: 32U4.30 21.92,10.52 22.66,11.25 22.66,11.87 U$8.30
  Top 0.406: JP5.6 21.08,9.42 32U4.30
PB7  (via drill 0.33)
  Top 0.254: U$8.12 24.27,21.77 32U4.12
  Top 0.406: v33.78,29.46 33.78,28.45 32.26,26.92 23.62,26.92 v22.35,25.65 | v23.88,23.62 23.88,22.68 32U4.12
  Bottom 0.254: JP3.3 46.1,11.43 44.96,11.43 42.67,13.72 42.67,29.97 42.16,30.48 34.04,30.48 33.78,30.23 v33.78,29.46
  Bottom 0.406: v22.35,25.65 22.35,25.15 v23.88,23.62
PD2
  Top 0.254: U$8.20 21.47,16.81 20.98,17.3 19.69,17.3 32U4.20
  Top 0.406: 32U4.20 17.94,19.05 17.02,19.05 13.72,22.35 JP6.2
PD3
  Top 0.254: U$8.21 20.8,16.82 20.42,16.82 20.24,16.64 19.22,16.64 32U4.21
  Top 0.406: 32U4.21 18.48,17.33 17.53,18.29 16.51,18.29 13.21,21.59 5.84,21.59 5.08,20.83 3.56,20.83 2.03,22.35 JP6.1
PD4
  Top 0.254: 32U4.25 19.11,13.09 19.86,13.84 19.99,13.72 21.02,13.72 U$8.25
  Top 0.406: 32U4.25 19.09,13 14.48,8.38 14.48,5.33 10.92,1.78 JP5.2
PD5  (via drill 0.33)
  Top 0.254: U$8.22 18.61,16.11 32U4.22
  Top 0.406: JP5.1 8.38,7.19 9.14,7.95 v9.14,8.64 | 32U4.22 17.96,16.69 v17.27,16
  Bottom 0.406: v17.27,16 16.51,16 v9.14,8.64
PD6
  Top 0.254: 32U4.26 19.66,12.55 20.32,13.21 21.22,13.21 U$8.26
  Top 0.406: JP5.3 13.46,3.3 15.24,5.08 15.24,8.11 32U4.26
PD7
  Top 0.254: 32U4.27 20.34,11.96 21.08,12.7 21.39,12.7 U$8.27
  Top 0.406: JP5.4 16,7.74 32U4.27
PE6  (via drill 0.33)
  Top 0.254: 32U4.1 31.75,16.77 30.99,16 29.1,16 U$8.1
  Top 0.406: 32U4.1 v33.27,16.76
  Bottom 0.406: v33.27,16.76 34.29,15.75 34.29,12.19 35.81,10.67 44.07,10.67 JP3.2
PF0  (via drill 0.33)
  Top 0.254: 32U4.41 29.79,12.52 29.01,13.31 28.46,13.31 U$8.41
  Top 0.406: v32,10.92 30.99,11.94 30.73,11.94 30.15,12.52 32U4.41
  Bottom 0.406: JP2.1 39.37,3.56 37.59,3.56 35.56,5.59 34.54,5.59 32.77,7.37 32.77,10.16 v32,10.92
PF1  (via drill 0.33)
  Top 0.254: 32U4.40 29.29,11.96 28.45,12.8 28.29,12.8 U$8.40
  Top 0.406: v30.73,10.92 30.43,11.23 30.28,11.23 29.56,11.95 32U4.40
  Bottom 0.406: JP2.2 38.1,1.78 35.56,4.32 34.29,4.32 31.75,6.86 31.75,9.91 v30.73,10.92
PF4  (via drill 0.33)
  Top 0.254: 32U4.39 U$8.39
  Top 0.406: v30.48,9.91 32U4.39
  Bottom 0.406: v30.48,9.91 30.99,9.4 30.99,6.35 34.04,3.3 35.05,3.3 36.32,2.03 JP2.3
PF5
  Top 0.254: 32U4.38 28.43,10.94 27.69,11.68 27.69,11.99 U$8.38
  Top 0.406: JP2.4 30.23,5.08 30.23,9.03 32U4.38
PF6
  Top 0.254: 32U4.37 27.86,10.49 27.18,11.18 27.18,11.82 U$8.37
  Top 0.406: JP2.5 29.46,3.05 29.46,8.64 27.86,10.24 32U4.37
PF7  (via drill 0.33)
  Top 0.254: 32U4.36 27.3,10.04 26.67,10.67 26.67,11.62 U$8.36 | v8.64,12.19 9.4,11.43 9.91,11.43 11.34,12.87 R10.1
  Top 0.406: JP2.6 28.45,1.78 28.45,8.54 32U4.36 | S2.GND v8.64,12.19
  Bottom 0.406: v8.64,12.19 6.35,9.91 6.35,6.86 9.4,3.81 27.18,3.81 28.7,2.29 JP2.6
RES  (via drill 0.33)
  Top 0.254: 32U4.29 21.36,10.94 22.1,11.68 22.1,11.99 U$8.29 24.08,13.97 v24.13,13.97
  Bottom 0.254: v24.13,13.97 25.4,15.24 25.4,27.18 24.03,28.54 DIS.4
RST
  Top 0.203: 23.67,19.48 23.67,21.24
  Top 0.254: U$8.13 23.67,19.48 | 23.67,21.24 32U4.13
  Top 0.406: J2.5 34.29,25.15 23.88,25.15 22.35,23.62 22.35,22.56 32U4.13
SCL  (via drill 0.33)
  Top 0.254: 32U4.18 20.26,19.03 20.96,18.34 21.29,18.34 22.12,17.5 U$8.18 23.11,16.57 v23.11,16.26 | R4.1 12.77,26.35 15.49,23.62 15.75,23.62 v16.51,22.86
  Top 0.406: JP1.2 12.69,26.49 R4.1
  Bottom 0.254: v16.51,22.86 v23.11,16.26
SCLK  (via drill 0.33)
  Top 0.203: U$8.9 26.21,18.94 26.59,19.33 26.59,20.59 32U4.9
  Top 0.406: 32U4.9 27.31,21.29 v28.22,22.2
  Bottom 0.406: 28.12,24.64 28.12,28.95 DIS.6 | J2.3 38.35,25.65 37.34,24.64 28.12,24.64 | 28.12,24.64 28.22,24.54 v28.22,22.2
SDA  (via drill 0.33)
  Top 0.254: 32U4.19 20.37,17.75 21.23,17.75 21.83,17.16 U$8.19 22.35,16.65 22.35,16.26 22.1,16 v22.1,15.49 | R5.1 12.77,28.26 v12.45,27.94
  Top 0.406: JP1.1 12.59,29.39 R5.1
  Bottom 0.254: v12.45,27.94 12.45,25.15 v22.1,15.49
USB_C_N
  Top 0.203: U$7.P2 45.09,14.87 43.76,13.54 39.12,13.54 37.83,12.25 R1.1
USB_C_P
  Top 0.203: U$7.P3 45.24,15.57 43.61,13.89 42.16,13.89 arc-90 41.87,14.19 41.87,14.4 arc90 41.58,14.69 40.1,14.69 arc90 39.8,14.4 39.8,14.19 arc-90 39.51,13.89 38.16,13.89 R2.1
USB_ID  (via drill 0.33)
  Top 0.406: U$7.P4 44.28,16.17 v43.94,16.51
  Bottom 0.406: v43.94,16.51 43.94,18.8 45.97,20.83 47.24,20.83 JP4.1
XTAL1
  Top 0.254: U$8.17 32U4.17 20.07,20.32 19.56,20.32 19.3,20.07 18.12,20.07 Y1.1
XTAL2
  Top 0.254: U$8.16 22.23,18.87 22.23,19.29 32U4.16 21.36,20.22 Y1.3

### Text on the board
tPlace: SDA | SCL | ID | 10k | friedcircuits.us / SUPEROLED8 v1.1 | PE6 | PB7 | AREF | 5V | PD5 | PD4 | PD6 | PD7 | PB4 | PB6 | G | PF7 / BTN | PF6 | PF5 | PF4 | PF1 | PF0
bPlace: RES | DC | CLK | DATA | N/C | VIN | GND | CS | 3/30/2016 | friedcircuits.us / SUPEROLED8 v1.1